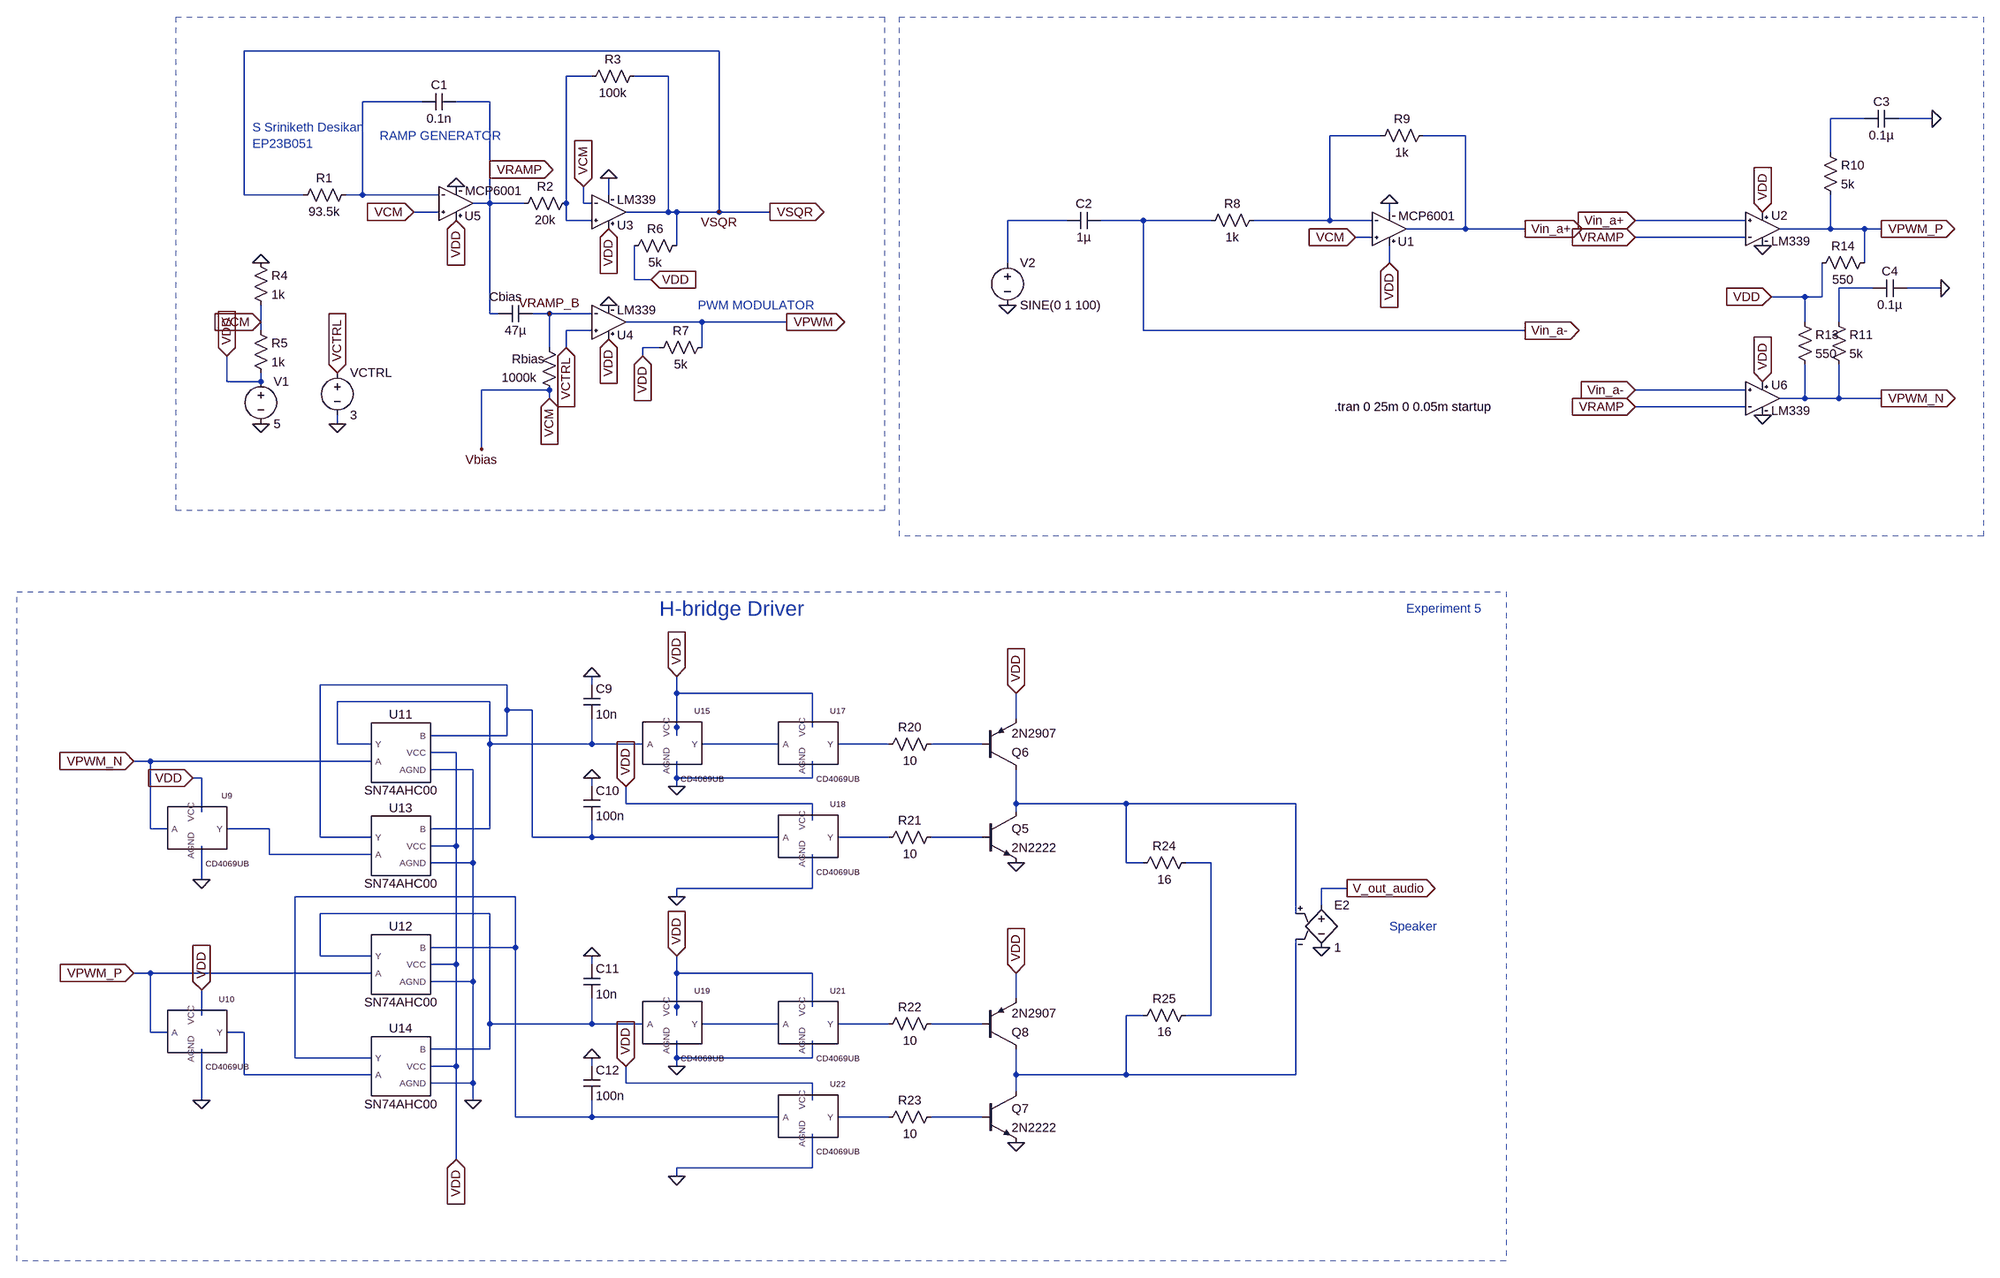
[diagram p0: schematic Experiment 5 - H-bridge driver.asc]
Experiment 5 - H-bridge driver.asc, the LTspice schematic file:
Version 4
SHEET 1 3688 3088
WIRE 864 -112 -32 -112
WIRE 624 -64 576 -64
WIRE 768 -64 704 -64
WIRE 304 -16 192 -16
WIRE 432 -16 368 -16
WIRE 3024 16 2960 16
WIRE 3152 16 3088 16
WIRE 2112 48 2016 48
WIRE 2272 48 2192 48
WIRE 2960 80 2960 16
WIRE 432 112 432 -16
WIRE -32 160 -32 -112
WIRE 80 160 -32 160
WIRE 192 160 192 -16
WIRE 192 160 160 160
WIRE 336 160 192 160
WIRE 656 160 656 128
WIRE 432 176 432 112
WIRE 432 176 400 176
WIRE 496 176 432 176
WIRE 576 176 576 -64
WIRE 608 176 608 144
WIRE 624 176 608 176
WIRE 336 192 288 192
WIRE 768 192 768 -64
WIRE 768 192 688 192
WIRE 784 192 768 192
WIRE 864 192 864 -112
WIRE 864 192 784 192
WIRE 960 192 864 192
WIRE 2128 192 2128 176
WIRE 576 208 576 176
WIRE 624 208 576 208
WIRE 1520 208 1408 208
WIRE 1664 208 1584 208
WIRE 1792 208 1664 208
WIRE 2016 208 2016 48
WIRE 2016 208 1872 208
WIRE 2096 208 2016 208
WIRE 2800 208 2592 208
WIRE 2272 224 2272 48
WIRE 2272 224 2160 224
WIRE 2384 224 2272 224
WIRE 2960 224 2960 160
WIRE 2960 224 2864 224
WIRE 3024 224 2960 224
WIRE 3056 224 3024 224
WIRE 2096 240 2064 240
WIRE 2800 240 2592 240
WIRE 784 256 784 192
WIRE 1408 288 1408 208
WIRE 2128 288 2128 256
WIRE 3024 288 3024 224
WIRE 704 320 704 256
WIRE 736 320 704 320
WIRE 3040 336 2976 336
WIRE 3168 336 3104 336
WIRE 2912 352 2848 352
WIRE 2944 352 2944 288
WIRE 2944 352 2912 352
WIRE 432 384 432 176
WIRE 448 384 432 384
WIRE 544 384 512 384
WIRE 624 384 544 384
WIRE 0 400 0 368
WIRE 832 400 688 400
WIRE 992 400 832 400
WIRE 2912 400 2912 352
WIRE 2976 400 2976 336
WIRE 0 416 0 400
WIRE 624 416 576 416
WIRE 1664 416 1664 208
WIRE 2384 416 1664 416
WIRE 544 448 544 384
WIRE 576 448 576 416
WIRE 752 448 720 448
WIRE 832 448 832 400
WIRE 720 464 720 448
WIRE -64 512 -64 464
WIRE 0 512 0 496
WIRE 0 512 -64 512
WIRE 544 528 416 528
WIRE 2800 528 2592 528
WIRE 544 544 544 528
WIRE 2912 544 2912 480
WIRE 2912 544 2864 544
WIRE 2976 544 2976 480
WIRE 2976 544 2912 544
WIRE 3056 544 2976 544
WIRE 2800 560 2592 560
WIRE 144 592 144 576
WIRE 416 640 416 528
WIRE 464 1248 112 1248
WIRE 624 1248 624 1232
WIRE 784 1264 784 1232
WIRE 1040 1264 784 1264
WIRE 432 1280 144 1280
WIRE 464 1296 464 1248
WIRE 512 1296 464 1296
WIRE 1424 1312 1424 1264
WIRE 784 1328 784 1264
WIRE 1040 1328 1040 1264
WIRE 464 1344 464 1296
WIRE 464 1344 320 1344
WIRE 784 1344 784 1328
WIRE 144 1360 144 1280
WIRE 208 1360 144 1360
WIRE 432 1360 432 1280
WIRE 624 1360 624 1312
WIRE 624 1360 432 1360
WIRE 720 1360 624 1360
WIRE 976 1360 832 1360
WIRE 1184 1360 1088 1360
WIRE 1360 1360 1264 1360
WIRE 368 1376 320 1376
WIRE -208 1392 -240 1392
WIRE 208 1392 -208 1392
WIRE 400 1408 320 1408
WIRE -112 1424 -128 1424
WIRE 784 1424 784 1392
WIRE 1040 1424 1040 1392
WIRE 1040 1424 784 1424
WIRE 624 1440 624 1424
WIRE 784 1440 784 1424
WIRE 688 1472 688 1440
WIRE 1040 1472 688 1472
WIRE 1424 1472 1424 1408
WIRE 1632 1472 1424 1472
WIRE 1952 1472 1632 1472
WIRE -112 1488 -112 1424
WIRE 1424 1488 1424 1472
WIRE 1040 1504 1040 1472
WIRE -208 1520 -208 1392
WIRE -176 1520 -208 1520
WIRE 16 1520 -64 1520
WIRE 432 1520 432 1360
WIRE 432 1520 320 1520
WIRE 112 1536 112 1248
WIRE 208 1536 112 1536
WIRE 512 1536 512 1296
WIRE 624 1536 624 1504
WIRE 624 1536 512 1536
WIRE 976 1536 624 1536
WIRE 1184 1536 1088 1536
WIRE 1360 1536 1264 1536
WIRE 368 1552 368 1376
WIRE 368 1552 320 1552
WIRE 16 1568 16 1520
WIRE 208 1568 16 1568
WIRE 400 1584 400 1408
WIRE 400 1584 320 1584
WIRE 1632 1584 1632 1472
WIRE 1664 1584 1632 1584
WIRE 1792 1584 1744 1584
WIRE -112 1616 -112 1552
WIRE 1040 1632 1040 1568
WIRE 1040 1632 784 1632
WIRE 2048 1632 2000 1632
WIRE 480 1648 64 1648
WIRE 784 1648 784 1632
WIRE 2000 1664 2000 1632
WIRE 432 1680 112 1680
WIRE 1952 1680 1952 1472
WIRE 480 1744 480 1648
WIRE 480 1744 320 1744
WIRE 112 1760 112 1680
WIRE 208 1760 112 1760
WIRE 368 1776 368 1552
WIRE 368 1776 320 1776
WIRE 624 1776 624 1760
WIRE -208 1792 -240 1792
WIRE 208 1792 -208 1792
WIRE 784 1792 784 1760
WIRE 1040 1792 784 1792
WIRE 400 1808 400 1584
WIRE 400 1808 320 1808
WIRE 1424 1840 1424 1792
WIRE 784 1856 784 1792
WIRE 1040 1856 1040 1792
WIRE -112 1872 -112 1824
WIRE 784 1872 784 1856
WIRE 1664 1872 1632 1872
WIRE 1792 1872 1792 1584
WIRE 1792 1872 1744 1872
WIRE 432 1888 432 1680
WIRE 624 1888 624 1840
WIRE 624 1888 432 1888
WIRE 720 1888 624 1888
WIRE 976 1888 832 1888
WIRE 1184 1888 1088 1888
WIRE 1360 1888 1264 1888
WIRE -208 1904 -208 1792
WIRE -176 1904 -208 1904
WIRE -32 1904 -64 1904
WIRE 432 1936 432 1888
WIRE 432 1936 320 1936
WIRE 64 1952 64 1648
WIRE 208 1952 64 1952
WIRE 784 1952 784 1920
WIRE 1040 1952 1040 1920
WIRE 1040 1952 784 1952
WIRE 368 1968 368 1776
WIRE 368 1968 320 1968
WIRE 624 1968 624 1952
WIRE 784 1968 784 1952
WIRE -32 1984 -32 1904
WIRE 208 1984 -32 1984
WIRE 1424 1984 1424 1936
WIRE 1632 1984 1632 1872
WIRE 1632 1984 1424 1984
WIRE 1952 1984 1952 1728
WIRE 1952 1984 1632 1984
WIRE 400 2000 400 1808
WIRE 400 2000 320 2000
WIRE 688 2000 688 1968
WIRE 1040 2000 688 2000
WIRE 1424 2016 1424 1984
WIRE -112 2032 -112 1936
WIRE 400 2032 400 2000
WIRE 1040 2032 1040 2000
WIRE 480 2064 480 1744
WIRE 624 2064 624 2032
WIRE 624 2064 480 2064
WIRE 976 2064 624 2064
WIRE 1184 2064 1088 2064
WIRE 1360 2064 1264 2064
WIRE 368 2144 368 1968
WIRE 1040 2160 1040 2096
WIRE 1040 2160 784 2160
WIRE 784 2176 784 2160
FLAG 0 400 VCM
IOPIN 0 400 In
FLAG 544 384 VRAMP_B
FLAG 864 192 VSQR
FLAG 144 592 0
FLAG 144 496 VCTRL
IOPIN 144 496 In
FLAG 0 592 0
FLAG 288 192 VCM
IOPIN 288 192 In
FLAG 608 144 VCM
IOPIN 608 144 In
FLAG 992 400 VPWM
IOPIN 992 400 Out
FLAG 432 112 VRAMP
IOPIN 432 112 Out
FLAG 576 448 VCTRL
IOPIN 576 448 In
FLAG 0 288 0
FLAG 960 192 VSQR
IOPIN 960 192 Out
FLAG 368 144 0
FLAG 656 128 0
FLAG 656 368 0
FLAG 368 208 VDD
IOPIN 368 208 In
FLAG 656 224 VDD
IOPIN 656 224 In
FLAG 656 432 VDD
IOPIN 656 432 In
FLAG 736 320 VDD
IOPIN 736 320 In
FLAG 720 464 VDD
IOPIN 720 464 In
FLAG -64 464 VDD
IOPIN -64 464 In
FLAG 544 544 VCM
IOPIN 544 544 In
FLAG 416 640 Vbias
FLAG 2128 288 VDD
IOPIN 2128 288 In
FLAG 2128 176 0
FLAG 2384 224 Vin_a+
IOPIN 2384 224 Out
FLAG 2384 416 Vin_a-
IOPIN 2384 416 Out
FLAG 2064 240 VCM
IOPIN 2064 240 In
FLAG 2592 208 Vin_a+
IOPIN 2592 208 In
FLAG 2592 528 Vin_a-
IOPIN 2592 528 In
FLAG 2592 560 VRAMP
IOPIN 2592 560 In
FLAG 2592 240 VRAMP
IOPIN 2592 240 In
FLAG 2832 576 0
FLAG 2832 256 0
FLAG 2832 192 VDD
IOPIN 2832 192 In
FLAG 2832 512 VDD
IOPIN 2832 512 In
FLAG 3056 224 VPWM_P
IOPIN 3056 224 Out
FLAG 3056 544 VPWM_N
IOPIN 3056 544 Out
FLAG 1408 368 0
FLAG 3152 16 0
FLAG 3168 336 0
FLAG 2848 352 VDD
IOPIN 2848 352 In
FLAG -240 1392 VPWM_N
IOPIN -240 1392 In
FLAG -240 1792 VPWM_P
IOPIN -240 1792 In
FLAG 368 2144 VDD
IOPIN 368 2144 In
FLAG 400 2032 0
FLAG 624 1424 0
FLAG 624 1232 0
FLAG 784 1232 VDD
IOPIN 784 1232 In
FLAG 688 1440 VDD
IOPIN 688 1440 In
FLAG 784 1440 0
FLAG 784 1648 0
FLAG 624 1952 0
FLAG 624 1760 0
FLAG 784 1760 VDD
IOPIN 784 1760 In
FLAG 688 1968 VDD
IOPIN 688 1968 In
FLAG 784 1968 0
FLAG 784 2176 0
FLAG 2000 1744 0
FLAG 2048 1632 V_out_audio
IOPIN 2048 1632 Out
FLAG 1424 1584 0
FLAG 1424 2112 0
FLAG 1424 1264 VDD
IOPIN 1424 1264 In
FLAG 1424 1792 VDD
IOPIN 1424 1792 In
FLAG -128 1424 VDD
IOPIN -128 1424 In
FLAG -112 1824 VDD
IOPIN -112 1824 In
FLAG -112 1616 0
FLAG -112 2032 0
SYMBOL Res 592 160 R90
WINDOW 0 0 56 VBottom 2
WINDOW 3 32 56 VTop 2
SYMATTR InstName R2
SYMATTR Value 20k
SYMBOL Res 720 -80 R90
WINDOW 0 0 56 VBottom 2
WINDOW 3 32 56 VTop 2
SYMATTR InstName R3
SYMATTR Value 100k
SYMBOL Res 176 144 R90
WINDOW 0 0 56 VBottom 2
WINDOW 3 32 56 VTop 2
SYMATTR InstName R1
SYMATTR Value 93.5k
SYMBOL Cap 368 -32 R90
WINDOW 0 0 32 VBottom 2
WINDOW 3 32 32 VTop 2
SYMATTR InstName C1
SYMATTR Value 0.1n
SYMBOL Cap 512 368 R90
WINDOW 0 0 50 VBottom 2
WINDOW 3 32 32 VTop 2
SYMATTR InstName Cbias
SYMATTR Value 47µ
SYMBOL Voltage 144 480 R0
SYMATTR InstName VCTRL
SYMATTR Value 3
SYMBOL Res -16 272 R0
SYMATTR InstName R4
SYMATTR Value 1k
SYMBOL Res 528 432 R0
WINDOW 0 -55 38 Left 2
WINDOW 3 -74 73 Left 2
SYMATTR InstName Rbias
SYMATTR Value 1000k
SYMBOL Voltage 0 496 R0
SYMATTR InstName V1
SYMATTR Value 5
SYMBOL MCP6001 368 176 M180
SYMATTR InstName U5
SYMBOL LM339 688 192 M180
SYMATTR InstName U3
SYMBOL LM339 688 400 M180
SYMATTR InstName U4
SYMBOL Res 800 240 R90
WINDOW 0 0 56 VBottom 2
WINDOW 3 32 56 VTop 2
SYMATTR InstName R6
SYMATTR Value 5k
SYMBOL Res 848 432 R90
WINDOW 0 0 56 VBottom 2
WINDOW 3 32 56 VTop 2
SYMATTR InstName R7
SYMATTR Value 5k
SYMBOL Res -16 400 R0
SYMATTR InstName R5
SYMATTR Value 1k
SYMBOL Voltage 1408 272 R0
SYMATTR InstName V2
SYMATTR Value SINE(0 1 100)
SYMBOL Cap 1584 192 R90
WINDOW 0 0 32 VBottom 2
WINDOW 3 32 32 VTop 2
SYMATTR InstName C2
SYMATTR Value 1µ
SYMBOL Res 1888 192 R90
WINDOW 0 0 56 VBottom 2
WINDOW 3 32 56 VTop 2
SYMATTR InstName R8
SYMATTR Value 1k
SYMBOL Res 2208 32 R90
WINDOW 0 0 56 VBottom 2
WINDOW 3 32 56 VTop 2
SYMATTR InstName R9
SYMATTR Value 1k
SYMBOL MCP6001 2128 224 M180
SYMATTR InstName U1
SYMBOL LM339 2864 224 R0
SYMATTR InstName U2
SYMBOL LM339 2864 544 R0
SYMATTR InstName U6
SYMBOL Res 2944 64 R0
SYMATTR InstName R10
SYMATTR Value 5k
SYMBOL Cap 3088 0 R90
WINDOW 0 0 32 VBottom 2
WINDOW 3 32 32 VTop 2
SYMATTR InstName C3
SYMATTR Value 0.1µ
SYMBOL Res 2960 384 R0
SYMATTR InstName R11
SYMATTR Value 5k
SYMBOL Cap 3104 320 R90
WINDOW 0 0 32 VBottom 2
WINDOW 3 32 32 VTop 2
SYMATTR InstName C4
SYMATTR Value 0.1µ
SYMBOL Res 2896 384 R0
SYMATTR InstName R13
SYMATTR Value 550
SYMBOL Res 3040 272 R90
WINDOW 0 0 56 VBottom 2
WINDOW 3 32 56 VTop 2
SYMATTR InstName R14
SYMATTR Value 550
SYMBOL CD4069UB -128 1520 R0
SYMATTR InstName U9
SYMBOL CD4069UB -128 1904 R0
SYMATTR InstName U10
SYMBOL SN74AHC00 256 1376 R0
SYMATTR InstName U11
SYMBOL SN74AHC00 256 1776 R0
SYMATTR InstName U12
SYMBOL SN74AHC00 256 1552 R0
SYMATTR InstName U13
SYMBOL SN74AHC00 256 1968 R0
SYMATTR InstName U14
SYMBOL CD4069UB 768 1360 R0
SYMATTR InstName U15
SYMBOL Cap 608 1248 R0
SYMATTR InstName C9
SYMATTR Value 10n
SYMBOL Cap 608 1440 R0
SYMATTR InstName C10
SYMATTR Value 100n
SYMBOL CD4069UB 1024 1360 R0
SYMATTR InstName U17
SYMBOL CD4069UB 1024 1536 R0
SYMATTR InstName U18
SYMBOL CD4069UB 768 1888 R0
SYMATTR InstName U19
SYMBOL Cap 608 1776 R0
SYMATTR InstName C11
SYMATTR Value 10n
SYMBOL Cap 608 1968 R0
SYMATTR InstName C12
SYMATTR Value 100n
SYMBOL CD4069UB 1024 1888 R0
SYMATTR InstName U21
SYMBOL CD4069UB 1024 2064 R0
SYMATTR InstName U22
SYMBOL Res 1280 1344 R90
WINDOW 0 0 56 VBottom 2
WINDOW 3 32 56 VTop 2
SYMATTR InstName R20
SYMATTR Value 10
SYMBOL Res 1280 1520 R90
WINDOW 0 0 56 VBottom 2
WINDOW 3 32 56 VTop 2
SYMATTR InstName R21
SYMATTR Value 10
SYMBOL Res 1280 1872 R90
WINDOW 0 0 56 VBottom 2
WINDOW 3 32 56 VTop 2
SYMATTR InstName R22
SYMATTR Value 10
SYMBOL Res 1280 2048 R90
WINDOW 0 0 56 VBottom 2
WINDOW 3 32 56 VTop 2
SYMATTR InstName R23
SYMATTR Value 10
SYMBOL npn 1360 1488 R0
SYMATTR InstName Q5
SYMATTR Value 2N2222
SYMBOL pnp 1360 1408 M180
SYMATTR InstName Q6
SYMATTR Value 2N2907
SYMBOL npn 1360 2016 R0
SYMATTR InstName Q7
SYMATTR Value 2N2222
SYMBOL pnp 1360 1936 M180
SYMATTR InstName Q8
SYMATTR Value 2N2907
SYMBOL res 1760 1568 R90
WINDOW 0 0 56 VBottom 2
WINDOW 3 32 56 VTop 2
SYMATTR InstName R24
SYMATTR Value 16
SYMBOL res 1760 1856 R90
WINDOW 0 0 56 VBottom 2
WINDOW 3 32 56 VTop 2
SYMATTR InstName R25
SYMATTR Value 16
SYMBOL e 2000 1648 R0
SYMATTR InstName E2
SYMATTR Value 1
TEXT 224 48 Left 2 ;RAMP GENERATOR
TEXT 824 368 Left 2 ;PWM MODULATOR
TEXT 2024 560 Left 2 !.tran 0 25m 0 0.05m startup
TEXT -16 32 Left 2 ;S Sriniketh Desikan\nEP23B051
TEXT 2128 1704 Left 2 ;Speaker
TEXT 752 1104 Left 4 ;H-bridge Driver
TEXT 2160 1104 Left 2 ;Experiment 5
RECTANGLE Normal -160 -176 1176 756 2
RECTANGLE Normal 1204 -176 3248 804 2
RECTANGLE Normal -460 1072 2348 2336 2

The netlist it stands for:
* Experiment 5 - H-bridge driver.asc
R2 N001 VRAMP 20k
R3 VSQR N001 100k
R1 N002 VSQR 93.5k
C1 VRAMP N002 0.1n
Cbias VRAMP_B VRAMP 47µ
VCTRL VCTRL 0 3
R4 0 Vbias 1k
Rbias VRAMP_B Vbias 1000k
V1 VDD 0 5
XU5 Vbias N002 VDD 0 VRAMP MCP6001
XU3 N001 Vbias VDD 0 VSQR LM339
XU4 VCTRL VRAMP_B VDD 0 VPWM LM339
R6 VSQR VDD 5k
R7 VPWM VDD 5k
R5 Vbias VDD 1k
V2 N005 0 SINE(0 1 100)
C2 Vin_a- N005 1µ
R8 N004 Vin_a- 1k
R9 Vin_a+ N004 1k
XU1 Vbias N004 VDD 0 Vin_a+ MCP6001
XU2 Vin_a+ VRAMP VDD 0 VPWM_P LM339
XU6 Vin_a- VRAMP VDD 0 VPWM_N LM339
R10 N003 VPWM_P 5k
C3 0 N003 0.1µ
R11 N006 VPWM_N 5k
C4 0 N006 0.1µ
R13 VDD VPWM_N 550
R14 VPWM_P VDD 550
XU9 N013 VPWM_N VDD 0 CD4069UB  ; pins Y A VCC AGND
XU10 N023 VPWM_P VDD 0 CD4069UB  ; pins Y A VCC AGND
XU11 N008 VPWM_N N007 VDD 0 SN74AHC00  ; pins Y A B VCC AGND
XU12 N018 VPWM_P N017 VDD 0 SN74AHC00  ; pins Y A B VCC AGND
XU13 N007 N013 N008 VDD 0 SN74AHC00  ; pins Y A B VCC AGND
XU14 N017 N023 N018 VDD 0 SN74AHC00  ; pins Y A B VCC AGND
XU15 N009 N008 VDD 0 CD4069UB  ; pins Y A VCC AGND
C9 0 N008 10n
C10 0 N007 100n
XU17 N010 N009 VDD 0 CD4069UB  ; pins Y A VCC AGND
XU18 N014 N007 VDD 0 CD4069UB  ; pins Y A VCC AGND
XU19 N020 N018 VDD 0 CD4069UB  ; pins Y A VCC AGND
C11 0 N018 10n
C12 0 N017 100n
XU21 N021 N020 VDD 0 CD4069UB  ; pins Y A VCC AGND
XU22 N024 N017 VDD 0 CD4069UB  ; pins Y A VCC AGND
R20 N011 N010 10
R21 N015 N014 10
R22 N022 N021 10
R23 N025 N024 10
Q5 N012 N015 0 0 2N2222
Q6 N012 N011 VDD 0 2N2907
Q7 N019 N025 0 0 2N2222
Q8 N019 N022 VDD 0 2N2907
R24 N016 N012 16
R25 N016 N019 16
E2 V_out_audio 0 N012 N019 1
.model NPN NPN
.model PNP PNP
.lib standard.bjt
* RAMP GENERATOR
* PWM MODULATOR
.tran 0 25m 0 0.05m startup
* S Sriniketh Desikan
* EP23B051
* Speaker
* H-bridge Driver
* Experiment 5
.lib ./MCP6001.lib
.lib ./LM339.lib
.lib /Users/sriniketh/Sriniketh/(01) Academics/Experiment 2/CD4069UB.cir
.lib /Users/sriniketh/Library/CloudStorage/GoogleDrive-sriniketh.desikan@gmail.com/My Drive/Projects/Semester 4/EE2019/Lab/Experiment 2/SN74AHC00.cir
.backanno
.end